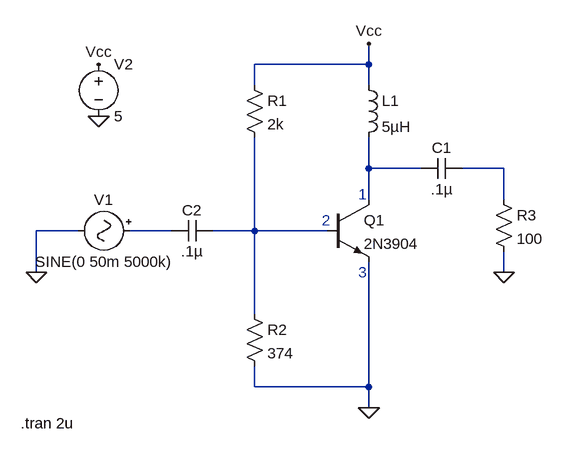
[diagram p0: schematic class-ab-rf.asc]
class-ab-rf.asc, the LTspice schematic file:
Version 4
SHEET 1 880 680
WIRE 352 -96 352 -128
WIRE 352 -96 176 -96
WIRE 176 -64 176 -96
WIRE 352 -64 352 -96
WIRE 352 64 352 16
WIRE 432 64 352 64
WIRE 560 64 496 64
WIRE 352 112 352 64
WIRE 560 112 560 64
WIRE -96 160 -160 160
WIRE 48 160 -16 160
WIRE 176 160 176 16
WIRE 176 160 112 160
WIRE 288 160 176 160
WIRE -160 224 -160 160
WIRE 560 224 560 192
WIRE 176 288 176 160
WIRE 176 400 176 368
WIRE 352 400 352 208
WIRE 352 400 176 400
WIRE 352 432 352 400
FLAG -160 224 0
FLAG 560 224 0
FLAG 352 432 0
FLAG -64 -16 0
FLAG -64 -96 Vcc
FLAG 352 -128 Vcc
SYMBOL Misc\\signal 0 160 R90
WINDOW 0 -32 56 VBottom 2
WINDOW 3 32 56 VTop 2
WINDOW 123 0 0 Left 0
WINDOW 39 0 0 Left 0
SYMATTR InstName V1
SYMATTR Value SINE(0 50m 5000k)
SYMBOL npn 288 112 R0
SYMATTR InstName Q1
SYMATTR Value 2N3904
SYMBOL ind 336 -80 R0
SYMATTR InstName L1
SYMATTR Value 5µH
SYMBOL res 160 -80 R0
SYMATTR InstName R1
SYMATTR Value 2k
SYMBOL res 160 272 R0
SYMATTR InstName R2
SYMATTR Value 374
SYMBOL cap 496 48 R90
WINDOW 0 0 32 VBottom 2
WINDOW 3 32 32 VTop 2
SYMATTR InstName C1
SYMATTR Value .1µ
SYMBOL res 544 96 R0
SYMATTR InstName R3
SYMATTR Value 100
SYMBOL cap 112 144 R90
WINDOW 0 0 32 VBottom 2
WINDOW 3 32 32 VTop 2
SYMATTR InstName C2
SYMATTR Value .1µ
SYMBOL voltage -64 -112 R0
WINDOW 123 0 0 Left 0
WINDOW 39 0 0 Left 0
SYMATTR InstName V2
SYMATTR Value 5
TEXT -184 456 Left 2 !.tran 2u
TEXT 336 104 Left 2 ;1
TEXT 280 144 Left 2 ;2
TEXT 336 224 Left 2 ;3

The netlist it stands for:
* class-ab-rf.asc
V1 N003 0 SINE(0 50m 5000k)
Q1 N001 N004 0 0 2N3904
L1 Vcc N001 5µH
R1 Vcc N004 2k
R2 N004 0 374
C1 N002 N001 .1µ
R3 N002 0 100
C2 N004 N003 .1µ
V2 Vcc 0 5
.model NPN NPN
.model PNP PNP
.lib standard.bjt
.tran 2u
* 1
* 2
* 3
.backanno
.end